# Altium schematic sheet Zynq_JTAG_Programmer.SchDoc: Zynq JTAG Programmer (part 1 of 2)
size A3; DrawnBy: Emre Can Damyanlı; Revision: A.1; SheetNumber: 4; SheetTotal: 4; ENG_APP_DATE: --/--/--; DSN_APP_DATE: --/--/--; CHK_APP_DATE: --/--/--
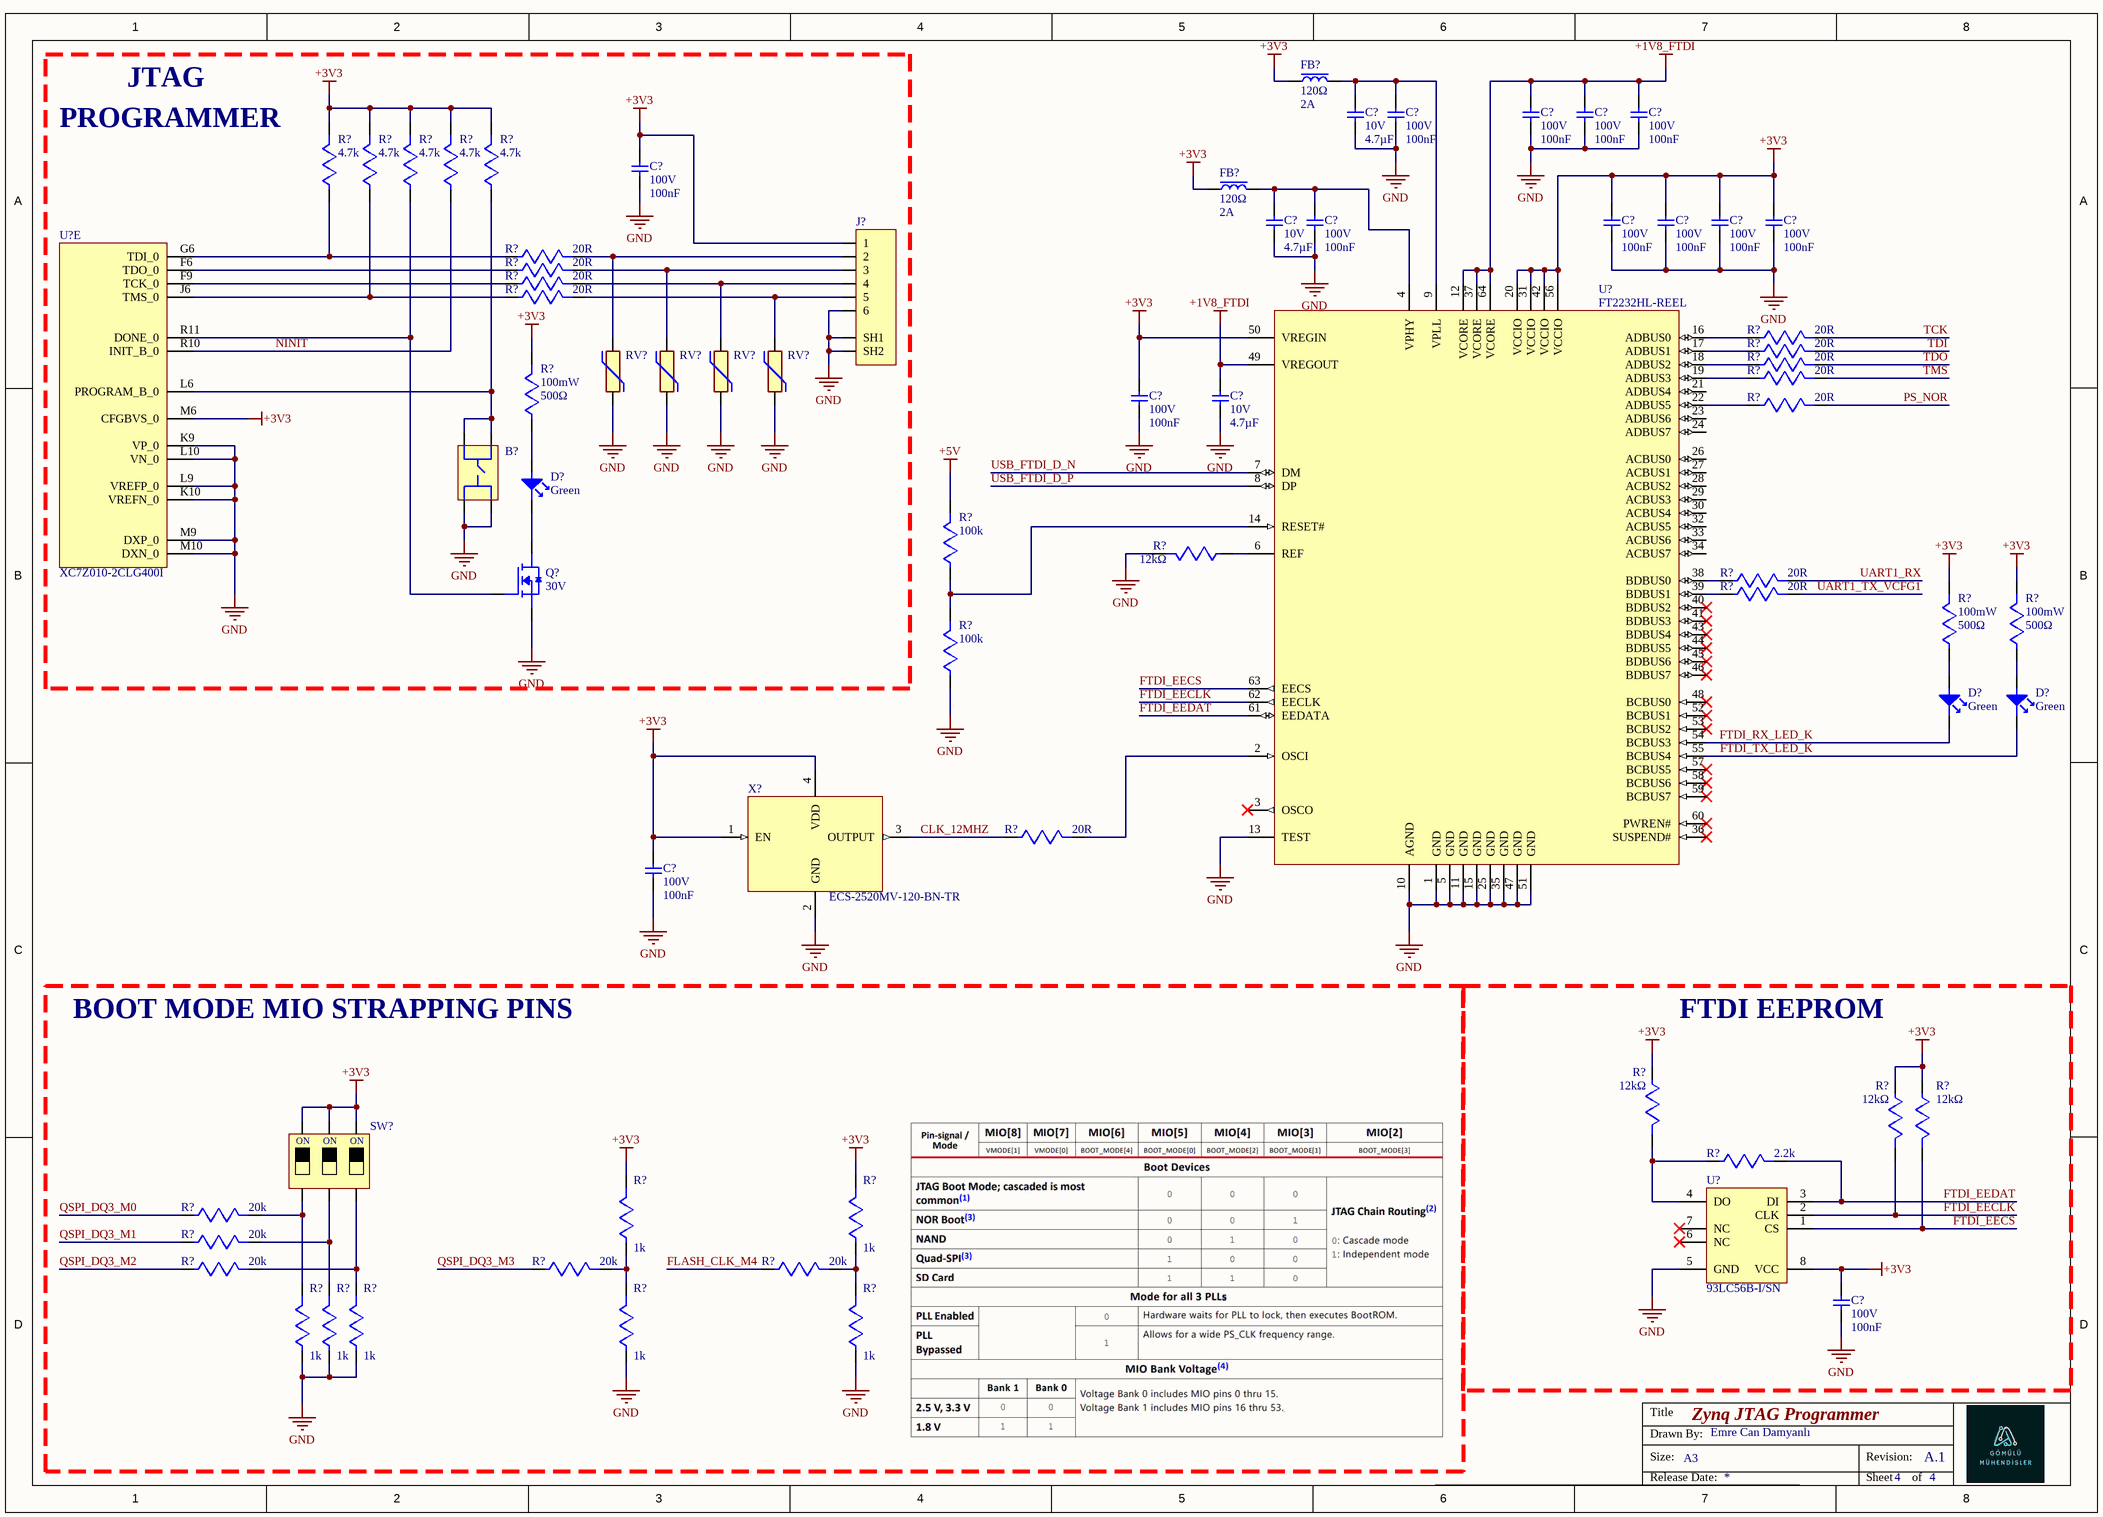
[diagram p0: Zynq_JTAG_Programmer.SchDoc]

## Parts
(Parts that share a designator on the sheet are numbered #1, #2 ... from top to bottom, then left to right.)
B?  GSPTS0020  [SW4_PTS815 SJM 250 SMTR LFS_CNK]  (value not drawn)
C?#1  value 100nF  Voltage Rating: 100V  [CAPC1608X94N]  (hidden comment: GCJ188R72A104KA01D)
C?#2  value 100nF  Voltage Rating: 100V  [CAPC1608X94N]  (hidden comment: GCJ188R72A104KA01D)
C?#3  value 100nF  Voltage Rating: 100V  [CAPC1608X94N]  (hidden comment: GCJ188R72A104KA01D)
C?#4  value 100nF  Voltage Rating: 100V  [CAPC1608X94N]  (hidden comment: GCJ188R72A104KA01D)
C?#5  value 4.7µF  Voltage Rating: 10V  [CAPC1005X55N]  (hidden comment: CL05A475MP5NRNC)
C?#6  value 100nF  Voltage Rating: 100V  [CAPC1608X94N]  (hidden comment: GCJ188R72A104KA01D)
C?#7  value 100nF  Voltage Rating: 100V  [CAPC1608X94N]  (hidden comment: GCJ188R72A104KA01D)
C?#8  value 100nF  Voltage Rating: 100V  [CAPC1608X94N]  (hidden comment: GCJ188R72A104KA01D)
C?#9  value 100nF  Voltage Rating: 100V  [CAPC1608X94N]  (hidden comment: GCJ188R72A104KA01D)
C?#10  value 100nF  Voltage Rating: 100V  [CAPC1608X94N]  (hidden comment: GCJ188R72A104KA01D)
C?#11  value 100nF  Voltage Rating: 100V  [CAPC1608X94N]  (hidden comment: GCJ188R72A104KA01D)
C?#12  value 4.7µF  Voltage Rating: 10V  [CAPC1005X55N]  (hidden comment: CL05A475MP5NRNC)
C?#13  value 100nF  Voltage Rating: 100V  [CAPC1608X94N]  (hidden comment: GCJ188R72A104KA01D)
C?#14  value 4.7µF  Voltage Rating: 10V  [CAPC1005X55N]  (hidden comment: CL05A475MP5NRNC)
C?#15  value 100nF  Voltage Rating: 100V  [CAPC1608X94N]  (hidden comment: GCJ188R72A104KA01D)
C?#16  value 100nF  Voltage Rating: 100V  [CAPC1608X94N]  (hidden comment: GCJ188R72A104KA01D)
D?#1  Color: Green  [LED_0603_GREEN]  (hidden comment: LTST-C191KGKT)
D?#2  Color: Green  [LED_0603_GREEN]  (hidden comment: LTST-C191KGKT)
D?#3  Color: Green  [LED_0603_GREEN]  (hidden comment: LTST-C191KGKT)
FB?#1  Impedance: 120Ω  Max Current Rating: 2A  [FERRITE_0402]  (hidden comment: BLM15PX121SN1D)
FB?#2  Impedance: 120Ω  Max Current Rating: 2A  [FERRITE_0402]  (hidden comment: BLM15PX121SN1D)
J?  S6B-ZR-SM4A-TF  [JST_S6B-ZR-SM4A-TF(LF)(SN)]  (value not drawn)
Q?  Drain to Source Voltage (Vdss): 30V  [CDSOT23]  (hidden comment: DMG3402L-7)
R?#1  value 4.7k  [RESISTOR_0603]  (hidden comment: RC0603FR-074K7L)
R?#2  value 4.7k  [RESISTOR_0603]  (hidden comment: RC0603FR-074K7L)
R?#3  value 4.7k  [RESISTOR_0603]  (hidden comment: RC0603FR-074K7L)
R?#4  value 4.7k  [RESISTOR_0603]  (hidden comment: RC0603FR-074K7L)
R?#5  value 4.7k  [RESISTOR_0603]  (hidden comment: RC0603FR-074K7L)
R?#6  value 20R  (hidden comment: RC0603FR-0720RL)
R?#7  value 20R  (hidden comment: RC0603FR-0720RL)
R?#8  value 20R  (hidden comment: RC0603FR-0720RL)
R?#9  value 20R  (hidden comment: RC0603FR-0720RL)
R?#10  value 20R  (hidden comment: RC0603FR-0720RL)
R?#11  value 20R  (hidden comment: RC0603FR-0720RL)
R?#12  value 20R  (hidden comment: RC0603FR-0720RL)
R?#13  value 20R  (hidden comment: RC0603FR-0720RL)
R?#14  value 500Ω  Power Rating: 100mW  [RESISTOR_0603]  (hidden comment: RT0603BRC07500RL)
R?#15  value 20R  (hidden comment: RC0603FR-0720RL)
R?#16  value 100k  [RESISTOR_0603]  (hidden comment: RC0603FR-07100KL)
R?#17  value 12kΩ  [RESISTOR_0603]  (hidden comment: RC0603FR-0712KL)
R?#18  value 20R  (hidden comment: RC0603FR-0720RL)
R?#19  value 20R  (hidden comment: RC0603FR-0720RL)
R?#20  value 500Ω  Power Rating: 100mW  [RESISTOR_0603]  (hidden comment: RT0603BRC07500RL)
R?#21  value 500Ω  Power Rating: 100mW  [RESISTOR_0603]  (hidden comment: RT0603BRC07500RL)
R?#22  value 100k  [RESISTOR_0603]  (hidden comment: RC0603FR-07100KL)
R?#23  value 20R  (hidden comment: RC0603FR-0720RL)
R?#24  value 12kΩ  [RESISTOR_0603]  (hidden comment: RC0603FR-0712KL)
R?#25  value 12kΩ  [RESISTOR_0603]  (hidden comment: RC0603FR-0712KL)
R?#26  value 12kΩ  [RESISTOR_0603]  (hidden comment: RC0603FR-0712KL)
R?#27  value 2.2k  [RESISTOR_0603]  (hidden comment: RC0603FR-072K2L)
R?#28  value 20k  [RESISTOR_0603]  (hidden comment: RC0603FR-0720KL)
R?#29  value 1k  [RESISTOR_0603]  (hidden comment: RC0603FR-071KL)
R?#30  value 1k  [RESISTOR_0603]  (hidden comment: RC0603FR-071KL)
R?#31  value 20k  [RESISTOR_0603]  (hidden comment: RC0603FR-0720KL)
R?#32  value 20k  [RESISTOR_0603]  (hidden comment: RC0603FR-0720KL)
R?#33  value 20k  [RESISTOR_0603]  (hidden comment: RC0603FR-0720KL)
R?#34  value 20k  [RESISTOR_0603]  (hidden comment: RC0603FR-0720KL)
R?#35  value 1k  [RESISTOR_0603]  (hidden comment: RC0603FR-071KL)
R?#36  value 1k  [RESISTOR_0603]  (hidden comment: RC0603FR-071KL)
R?#37  value 1k  [RESISTOR_0603]  (hidden comment: RC0603FR-071KL)
R?#38  value 1k  [RESISTOR_0603]  (hidden comment: RC0603FR-071KL)
R?#39  value 1k  [RESISTOR_0603]  (hidden comment: RC0603FR-071KL)
RV?#1  CG0402MLU-3.3G  [VARC1005X41N]  (value not drawn)
RV?#2  CG0402MLU-3.3G  [VARC1005X41N]  (value not drawn)
RV?#3  CG0402MLU-3.3G  [VARC1005X41N]  (value not drawn)
RV?#4  CG0402MLU-3.3G  [VARC1005X41N]  (value not drawn)
SW?  219-3LPST  [2193LPST]  (value not drawn)
U?#1  XC7Z010-2CLG400I  [BGA400C80P20X20_1700X1700X160]  (part E of 9)
U?#2  FT2232HL-REEL  [LQFP-64-0.5mm]
U?#3  93LC56B-I/SN  [SOIC127P599X175-8N]
X?  ECS-2520MV-120-BN-TR  [OSCCC250X200X90N]

## Nets
+1V8_FTDI: C?#2.2 C?#3.2 C?#4.2 C?#14.2 U?#2.12(VCORE) U?#2.37(VCORE) U?#2.49(VREGOUT) U?#2.64(VCORE)
+3V3: C?#6.2 C?#8.2 C?#9.2 C?#10.2 C?#11.2 C?#13.2 C?#15.2 C?#16.2 FB?#1.1 FB?#2.1 J?.1 R?#1.2 R?#2.2 R?#3.2 R?#4.2 R?#5.2 R?#14.2 R?#20.2 R?#21.2 R?#24.1 R?#25.1 R?#26.1 R?#29.2 R?#30.2 SW?.4 SW?.5 SW?.6 U?#1.M6(CFGBVS_0) U?#2.20(VCCIO) U?#2.31(VCCIO) U?#2.42(VCCIO) U?#2.50(VREGIN) U?#2.56(VCCIO) U?#3.8(VCC) X?.1(EN) X?.4(VDD)
+5V: R?#16.2
GND: B?.3 B?.4 C?#1.1 C?#2.1 C?#3.1 C?#4.1 C?#5.1 C?#6.1 C?#7.1 C?#8.1 C?#9.1 C?#10.1 C?#11.1 C?#12.1 C?#13.1 C?#14.1 C?#15.1 C?#16.1 J?.6 J?.SH1 J?.SH2 Q?.2(S) R?#17.2 R?#22.1 R?#35.1 R?#36.1 R?#37.1 R?#38.1 R?#39.1 RV?#1.1 RV?#2.1 RV?#3.1 RV?#4.1 U?#1.K9(VP_0) U?#1.K10(VREFN_0) U?#1.L9(VREFP_0) U?#1.L10(VN_0) U?#1.M9(DXP_0) U?#1.M10(DXN_0) U?#2.1(GND) U?#2.5(GND) U?#2.10(AGND) U?#2.11(GND) U?#2.13(TEST) U?#2.15(GND) U?#2.25(GND) U?#2.35(GND) U?#2.47(GND) U?#2.51(GND) U?#3.5(GND) X?.2(GND)
CLK_12MHZ: R?#23.1 X?.3(OUTPUT)
FLASH_CLK_M4: R?#34.1
FTDI_EECLK: R?#25.2 U?#2.62(EECLK) U?#3.2(CLK)
FTDI_EECS: R?#26.2 U?#2.63(EECS) U?#3.1(CS)
FTDI_EEDAT: R?#27.2 U?#2.61(EEDATA) U?#3.3(DI)
FTDI_RX_LED_K: D?#2.2 U?#2.54(BCBUS3)
FTDI_TX_LED_K: D?#3.2 U?#2.55(BCBUS4)
NINIT: R?#4.1 U?#1.R10(INIT_B_0)
PS_NOR: R?#15.2
QSPI_DQ3_M0: R?#28.1
QSPI_DQ3_M1: R?#31.1
QSPI_DQ3_M2: R?#32.1
QSPI_DQ3_M3: R?#33.1
TCK: R?#10.2
TDI: R?#11.2
TDO: R?#12.2
TMS: R?#13.2
UART1_RX: R?#18.2
UART1_TX_VCFG1: R?#19.2
USB_FTDI_D_N: U?#2.7(DM)
USB_FTDI_D_P: U?#2.8(DP)
NetB?_1: B?.1 B?.2 R?#5.1 U?#1.L6(PROGRAM_B_0)
NetC?#1_2: C?#1.2 C?#5.2 FB?#1.2 U?#2.9(VPLL)
NetC?#7_2: C?#7.2 C?#12.2 FB?#2.2 U?#2.4(VPHY)
NetD?#1_1: D?#1.1 R?#14.1
NetD?#1_2: D?#1.2 Q?.3(D)
NetD?#2_1: D?#2.1 R?#20.1
NetD?#3_1: D?#3.1 R?#21.1
NetJ?_2: J?.2 R?#6.2 RV?#1.2
NetJ?_3: J?.3 R?#7.2 RV?#2.2
NetJ?_4: J?.4 R?#8.2 RV?#3.2
NetJ?_5: J?.5 R?#9.2 RV?#4.2
NetQ?_1: Q?.1(G) R?#3.1 U?#1.R11(DONE_0)
NetR?#1_1: R?#1.1 R?#6.1 U?#1.G6(TDI_0)
NetR?#2_1: R?#2.1 R?#9.1 U?#1.J6(TMS_0)
NetR?#7_1: R?#7.1 U?#1.F6(TDO_0)
NetR?#8_1: R?#8.1 U?#1.F9(TCK_0)
NetR?#10_1: R?#10.1 U?#2.16(ADBUS0)
NetR?#11_1: R?#11.1 U?#2.17(ADBUS1)
NetR?#12_1: R?#12.1 U?#2.18(ADBUS2)
NetR?#13_1: R?#13.1 U?#2.19(ADBUS3)
NetR?#15_1: R?#15.1 U?#2.22(ADBUS5)
NetR?#16_1: R?#16.1 R?#22.2 U?#2.14(RESET#)
NetR?#17_1: R?#17.1 U?#2.6(REF)
NetR?#18_1: R?#18.1 U?#2.38(BDBUS0)
NetR?#19_1: R?#19.1 U?#2.39(BDBUS1)
NetR?#23_2: R?#23.2 U?#2.2(OSCI)
NetR?#24_2: R?#24.2 R?#27.1 U?#3.4(DO)
NetR?#28_2: R?#28.2 R?#35.2 SW?.1
NetR?#29_1: R?#29.1 R?#33.2 R?#38.2
NetR?#30_1: R?#30.1 R?#34.2 R?#39.2
NetR?#31_2: R?#31.2 R?#36.2 SW?.2
NetR?#32_2: R?#32.2 R?#37.2 SW?.3

Not connected (* = marked no-connect by the designer): U?#2 3(OSCO)* 21(ADBUS4) 23(ADBUS6) 24(ADBUS7) 26(ACBUS0) 27(ACBUS1) 28(ACBUS2) 29(ACBUS3) 30(ACBUS4) 32(ACBUS5) 33(ACBUS6) 34(ACBUS7) 36(SUSPEND#)* 40(BDBUS2)* 41(BDBUS3)* 43(BDBUS4)* 44(BDBUS5)* 45(BDBUS6)* 46(BDBUS7)* 48(BCBUS0)* 52(BCBUS1)* 53(BCBUS2)* 57(BCBUS5)* 58(BCBUS6)* 59(BCBUS7)* 60(PWREN#)*; U?#3 6(NC)* 7(NC)*

## Notes on the sheet
- JTAG
- PROGRAMMER
- BOOT MODE MIO STRAPPING PINS
- FTDI EEPROM
- Title
- Size:
- Drawn By:
- A3
- Revision:
- Release Date:
- Sheet
- of
- (in symbol 219-3LPST) ON